# Altium schematic sheet Driver.SchDoc
size A4
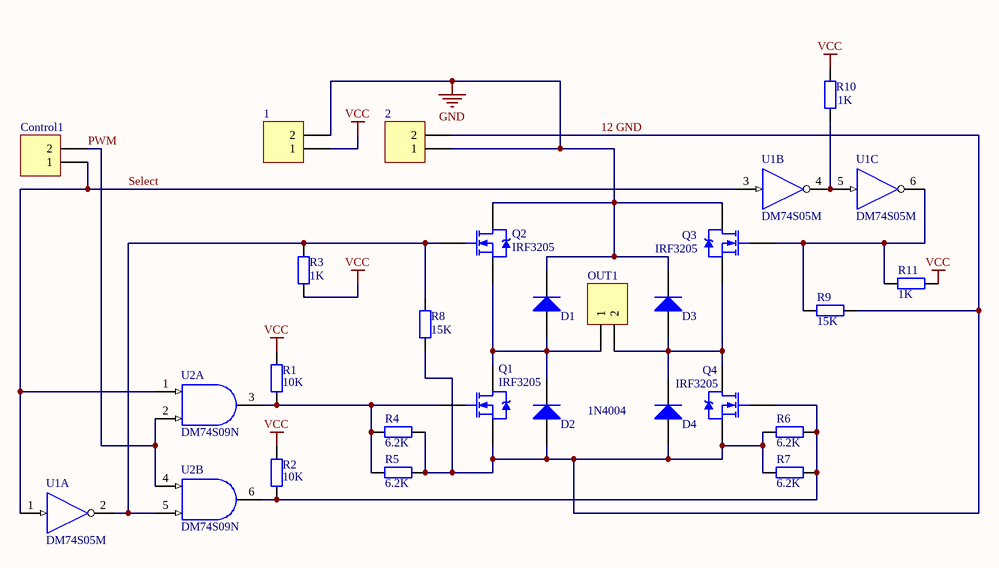
[diagram p0: Driver.SchDoc]

## Parts
1  Header 2  [HDR1X2]  (value not drawn)
2  Header 2  [HDR1X2]  (value not drawn)
Control1  Header 2  [HDR1X2]  (value not drawn)
D1  Diode 1N4004  [DIO10.46-5.3x2.8]  (value not drawn)
D2  1N4004  [DIO10.46-5.3x2.8]
D3  1N4004  [DIO10.46-5.3x2.8]  (value not drawn)
D4  Diode 1N4004  [DIO10.46-5.3x2.8]  (value not drawn)
OUT1  Header 2  [HDR1X2]  (value not drawn)
Q1  IRF3205  [TO-220AB]
Q2  IRF3205  [TO-220AB]
Q3  IRF3205  [TO-220AB]
Q4  IRF3205  [TO-220AB]
R1  value 10K  [AXIAL-0.4]  (hidden comment: Res2)
R2  value 10K  [AXIAL-0.4]  (hidden comment: Res2)
R3  value 1K  [AXIAL-0.4]  (hidden comment: Res2)
R4  value 6.2K  [AXIAL-0.4]  (hidden comment: Res2)
R5  value 6.2K  [AXIAL-0.4]  (hidden comment: Res2)
R6  value 6.2K  [AXIAL-0.4]  (hidden comment: Res2)
R7  value 6.2K  [AXIAL-0.4]  (hidden comment: Res2)
R8  value 15K  [AXIAL-0.4]  (hidden comment: Res2)
R9  value 15K  [AXIAL-0.4]  (hidden comment: Res2)
R10  value 1K  [AXIAL-0.4]  (hidden comment: Res2)
R11  value 1K  [AXIAL-0.4]  (hidden comment: Res2)
U1  DM74S05M  [M14A_N]  (parts A,B,C of 6)
U2  DM74S09N  [N14A]  (parts A,B of 4)

## Nets
GND: 1.2 2.1 D1.2(K) D3.2(K) Q2.2(D) Q3.2(D) U1.7(GND) U2.7(GND)
VCC: 1.1 R1.2 R2.2 R3.1 R10.2 R11.2 U1.14(VCC) U2.14(VCC)
12 GND: 2.2 D2.1(A) D4.1(A) Q1.3(S) Q4.3(S) R4.2 R5.2 R6.1 R7.1 R8.1 R9.1
PWM: Control1.2 U2.2(B) U2.4(A)
Select: Control1.1 U1.1(A) U1.3(A) U2.1(A)
NetD1_1: D1.1(A) D2.2(K) OUT1.1 Q1.2(D) Q2.3(S)
NetD3_1: D3.1(A) D4.2(K) OUT1.2 Q3.3(S) Q4.2(D)
NetQ1_1: Q1.1(G) R1.1 R4.1 R5.1 U2.3(Y)
NetQ2_1: Q2.1(G) R3.2 R8.2 U1.2(Y) U2.5(B)
NetQ3_1: Q3.1(G) R9.2 R11.1 U1.6(Y)
NetQ4_1: Q4.1(G) R2.1 R6.2 R7.2 U2.6(Y)
NetR10_1: R10.1 U1.4(Y) U1.5(A)

## Library data of the parts
1 2 Control1 OUT1 = Header 2: Header, 2-Pin; LatestRevisionDate: 17-Jul-2002; LatestRevisionNote: Re-released for DXP Platform.; Publisher: Altium Limited
D1-D4 = Diode 1N4004: 1 Amp General Purpose Rectifier; Published: 8-Jun-2000; LatestRevisionDate: 17-Jul-2002; LatestRevisionNote: Re-released for DXP Platform.; DatasheetVersion: 1998; PackageVersion: Aug-1999; PackageReference: DO-41; Publisher: Altium Limited; Code_JEDEC: DO-204-AL; ComponentLink1Description: Manufacturer Link; ComponentLink1URL: http://www.fairchildsemi.com/; ComponentLink2Description: Datasheet; ComponentLink2URL: http://www.fairchildsemi.com/ds/1N%2F1N4001.pdf
Q1-Q4 = IRF3205: HEXFET Power MOSFET; Note: Pin 2 is electrically connected to pin 4.; Published: 8-Jun-2000; LatestRevisionDate: 17-Jul-2002; LatestRevisionNote: Re-released for DXP Platform.; DatasheetVersion: Aug-1997; PackageVersion: Feb-1997; PackageReference: TO-220AB; Publisher: Altium Limited; PackageDescription: TO, Thru-Hole, Vertical, Heatsink Mounted; 3 In-Line Leads; Pitch 2.54 mm; ComponentLink1Description: Manufacturer Link; ComponentLink1URL: http://www.irf.com/; ComponentLink2Description: Datasheet; ComponentLink2URL: http://www.irf.com/product-info/datasheets/data/irf3205.pdf
R1-R11 = Res2: Resistor; Published: 8-Jun-2000; LatestRevisionDate: 17-Jul-2002; LatestRevisionNote: Re-released for DXP Platform.; PackageReference: AXIAL-0.4; Publisher: Altium Limited
U1 = DM74S05M: Hex Inverter with Open-Collector Output, 14-Pin SOIC; IC_Technology: S; Published: 17-Jul-2002; LatestRevisionDate: 13-Apr-2006; LatestRevisionNote: IPC-7351 Footprint Added.; DatasheetVersion: Mar-1998; PackageVersion: 2000; PackageReference: M14A; Publisher: Altium Limited; PackageDescription: 14-Pin Small Outline Integrated Circuit 1.27 mm Pitch; Code_IPC: SOIC127P600-14; ComponentLink1Description: Manufacturer Link; ComponentLink1URL: http://www.fairchildsemi.com/
U2 = DM74S09N: Quad 2-Input AND Gate with Open-Collector Output, 14-Pin PDIP; IC_Technology: S; Published: 17-Jul-2002; LatestRevisionDate: 29-May-2009; LatestRevisionNote: Component Body Added.; DatasheetVersion: Mar-1998; PackageVersion: 2000; PackageReference: N14A; Publisher: Altium Limited; PackageDescription: DIP, 14-Pin, Row Spacing 7.62 mm, Pitch 2.54 mm; ComponentLink1Description: Manufacturer Link; ComponentLink1URL: http://www.fairchildsemi.com/